# Altium schematic sheet Digital to Analog.SchDoc
size A; SheetNumber: 4; SheetTotal: 5
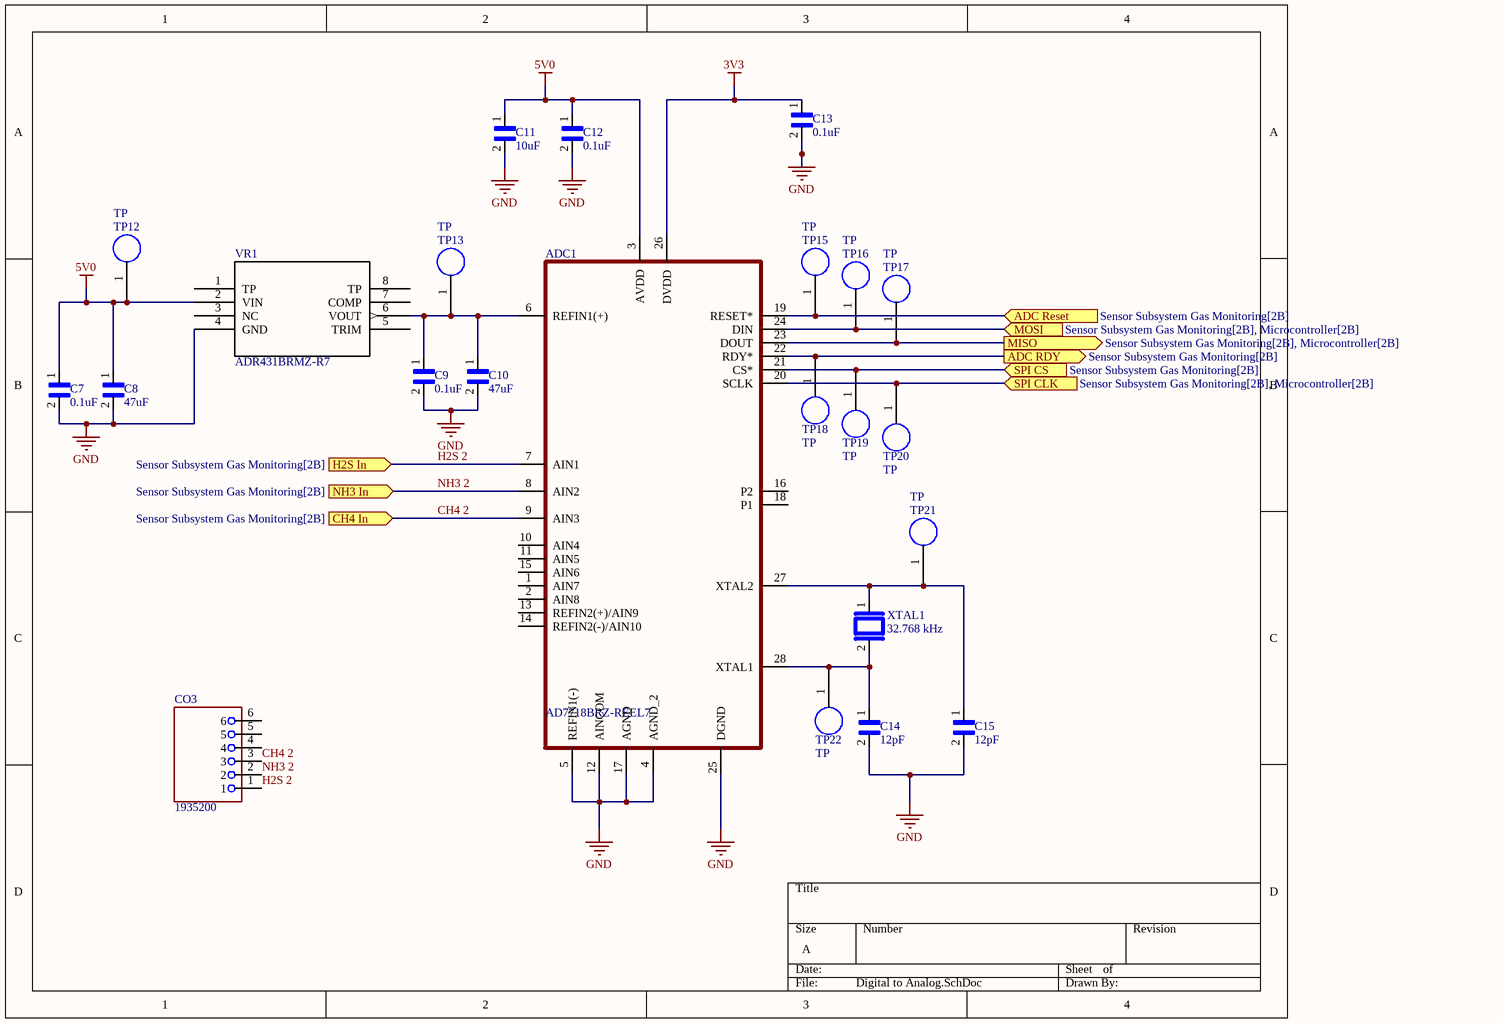
[diagram p0: Digital to Analog.SchDoc]

## Parts
ADC1  AD7718BRZ-REEL7  [SOIC127P1032X265-28N]
C7  0.1uF  [0.1uF Capacitor]
C8  47uF  [CAPC2012X135N]
C9  0.1uF  [0.1uF Capacitor]
C10  47uF  [CAPC2012X135N]
C11  10uF  [CAPC3216X190N]
C12  0.1uF  [0.1uF Capacitor]
C13  0.1uF  [0.1uF Capacitor]
C14  12pF  [CAPC1608X90N]
C15  12pF  [CAPC1608X90N]
CO3  1935200  [PHOENIX_1935200]
TP12  TP  [TestPoint]  (no BOM)
TP13  TP  [TestPoint]  (no BOM)
TP15  TP  [TestPoint]  (no BOM)
TP16  TP  [TestPoint]  (no BOM)
TP17  TP  [TestPoint]  (no BOM)
TP18  TP  [TestPoint]  (no BOM)
TP19  TP  [TestPoint]  (no BOM)
TP20  TP  [TestPoint]  (no BOM)
TP21  TP  [TestPoint]  (no BOM)
TP22  TP  [TestPoint]  (no BOM)
VR1  ADR431BRMZ-R7  [RM_8_ADI]
XTAL1  32.768 kHz  [XTAL_ABS07-32.768KHZ-T]

## Ports
ADC RDY (out, see Sensor Subsystem Gas Monitoring[2B]), ADC Reset (in, see Sensor Subsystem Gas Monitoring[2B]), CH4 In (in, see Sensor Subsystem Gas Monitoring[2B]), H2S In (in, see Sensor Subsystem Gas Monitoring[2B]), MISO (out, see Sensor Subsystem Gas Monitoring[2B], Microcontroller[2B]), MOSI (in, see Sensor Subsystem Gas Monitoring[2B], Microcontroller[2B]), NH3 In (in, see Sensor Subsystem Gas Monitoring[2B]), SPI CLK (in, see Sensor Subsystem Gas Monitoring[2B], Microcontroller[2B]), SPI CS (in, see Sensor Subsystem Gas Monitoring[2B])

## Nets
3V3: ADC1.26(DVDD) C13.1
5V0: ADC1.3(AVDD) C7.1 C8.1 C11.1 C12.1 TP12.1 VR1.2(VIN)
GND: ADC1.4(AGND_2) ADC1.5(REFIN1(-)) ADC1.12(AINCOM) ADC1.17(AGND) ADC1.25(DGND) C7.2 C8.2 C9.2 C10.2 C11.2 C12.2 C13.2 C14.2 C15.2 VR1.4(GND)
ADC RDY: ADC1.22(RDY*) TP18.1 ; port ADC RDY
ADC Reset: ADC1.19(RESET*) TP15.1 ; port ADC Reset
CH4 2: ADC1.9(AIN3) CO3.3 ; port CH4 In
H2S 2: ADC1.7(AIN1) CO3.1 ; port H2S In
MISO: ADC1.23(DOUT) TP17.1 ; port MISO
MOSI: ADC1.24(DIN) TP16.1 ; port MOSI
NH3 2: ADC1.8(AIN2) CO3.2 ; port NH3 In
SPI CLK: ADC1.20(SCLK) TP20.1 ; port SPI CLK
SPI CS: ADC1.21(CS*) TP19.1 ; port SPI CS
NetADC1_6: ADC1.6(REFIN1(+)) C9.1 C10.1 TP13.1 VR1.6(VOUT)
NetADC1_27: ADC1.27(XTAL2) C15.1 TP21.1 XTAL1.1
NetADC1_28: ADC1.28(XTAL1) C14.1 TP22.1 XTAL1.2

Not connected (* = marked no-connect by the designer): ADC1 1(AIN7) 2(AIN8) 10(AIN4) 11(AIN5) 13(REFIN2(+)/AIN9) 14(REFIN2(-)/AIN10) 15(AIN6) 16(P2) 18(P1); CO3 4 5 6; VR1 1(TP) 3(NC) 5(TRIM) 7(COMP) 8(TP)

## Library data of the parts
ADC1 = AD7718BRZ-REEL7: 24-Bit, 8/10-Channel, Low Voltage, Low Power, Sigma Delta ADC; MF: Analog Devices; SnapEDA_Link: https://www.snapeda.com/parts/AD7718BRZ-REEL7/Analog+Devices/view-part/?ref=snap; Package: SOIC -28 Analog Devices; Value: *; MP: AD7718BRZ-REEL7; Check_prices: https://www.snapeda.com/parts/AD7718BRZ-REEL7/Analog+Devices/view-part/?ref=eda
C7 C9 C12 C13 = CC1206JRX7R9BB104: No Description Available; Mfr_Name: Yageo
C8 C10 = CL21A476MQYNNNG: 47ÂµF Â±20% 6.3V Ceramic Capacitor X5R 0805 _2012 Metric_; MF: Samsung Electro-Mechanics; Digi-Key_Part_Number: 1276-6467-1-ND; MP: CL21A476MQYNNNG; SnapEDA_Link: https://www.snapeda.com/parts/CL21A476MQYNNNG/Samsung%20Electro-Mechanics/view-part/3597942/?ref=snap; Value: *; Package: 0805 Samsung; Digi-Key_Purchase_URL: https://www.digikey.com/product-detail/en/samsung-electro-mechanics/CL21A476MQYNNNG/1276-6467-1-ND/5958095?utm_source=snapeda&utm_medium=aggregator&utm_campaign=symbol
C11 = GRJ31CR61E106KE11L: CAP CER 10UF 25V X5R 1206; Package: None; Price: None; Value: *; MP: GRJ31CR61E106KE11L; Availability: Unavailable
C14 C15 = CGA3E2C0G1H120J080AA: Multilayer Ceramic Capacitor, CGA Series, 12 pF, - 5%, C0G / NP0, 50 V, 0603 [1608 Metric]; MF: TDK; SnapEDA_Link: https://www.snapeda.com/parts/CGA3E2C0G1H120J080AA/TDK/view-part/?ref=snap; Package: 1608 TDK; Value: *; MP: CGA3E2C0G1H120J080AA; Check_prices: https://www.snapeda.com/parts/CGA3E2C0G1H120J080AA/TDK/view-part/?ref=eda
CO3 = 1935200: PCB terminal block - nominal current: 17.5 A - rated voltage (III/2): 400 V - nominal cross section: 1.5 mm² - pitch: 5 mm - number of positions: 6 - connection method: Screw connection with wire protector - mounting: Wave soldering - conductor/PCB connection direction: 0 ° - color: green - Pin layout: Linear pinning - Solder pin [P]: 3.5 mm; MF: Littelfuse; SnapEDA_Link: https://www.snapeda.com/parts/1935200/Littelfuse/view-part/?ref=snap; Package: None; Value: *; MP: 1935200; Check_prices: https://www.snapeda.com/parts/1935200/Littelfuse/view-part/?ref=eda
TP12 TP13 TP15-TP22 = TestPoint: Test point for voltage, current, ect.
VR1 = ADR431BRMZ-R7: No Description Available; Mfr_Name: Analog Devices Inc; RefDes: RefDes; Type: Type
XTAL1 = ABS07-32.768KHZ-T: 32.768 kHz Â±20ppm Crystal 12.5pF 70 kOhms 2-SMD, No Lead; MF: Abracon; Availability: In Stock; SnapEDA_Link: https://www.snapeda.com/parts/ABS07-32.768KHZ-T/Abracon+LLC/view-part/?ref=snap; MP: ABS07-32.768KHZ-T; Price: None; Value: *; Check_prices: https://www.snapeda.com/parts/ABS07-32.768KHZ-T/Abracon+LLC/view-part/?ref=eda; Purchase-URL: https://pricing.snapeda.com/search/part/ABS07-32.768KHZ-T/?ref=eda; Package: SMD-2 Abracon LLC